# Altium schematic sheet 04.Mechanical.SchDoc
size A4; Organization: Electronic and Telecommunication Department - University of Moratuwa; Address1: Bandaranayake Mawatha; Address2: Moratuwa; Address3: Sri Lanka; Address4: 10400; DocumentNumber: 04; SheetNumber: 4; SheetTotal: 4; Page: Mechanical Information
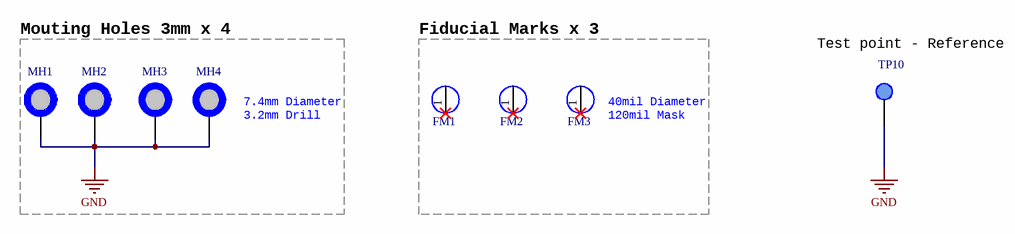
[diagram p0: 04.Mechanical.SchDoc]

## Parts
FM1  FM  [FM]  (value not drawn)  (no BOM)
FM2  FM  [FM]  (value not drawn)  (no BOM)
FM3  FM  [FM]  (value not drawn)  (no BOM)
MH1  MH_7.4MMC_3.2MMD  [MECHANICAL_M3]  (value not drawn)  (no BOM)
MH2  MH_7.4MMC_3.2MMD  [MECHANICAL_M3]  (value not drawn)  (no BOM)
MH3  MH_7.4MMC_3.2MMD  [MECHANICAL_M3]  (value not drawn)  (no BOM)
MH4  MH_7.4MMC_3.2MMD  [MECHANICAL_M3]  (value not drawn)  (no BOM)
TP10  (no value)  [tp]  (no BOM)

## Blocks framed on the sheet
Mouting Holes 3mm x 4: MH1-MH4
Fiducial Marks x 3: FM1-FM3

## Nets
GND: MH1.1 MH2.1 MH3.1 MH4.1 TP10.1(TP)

Not connected (* = marked no-connect by the designer): FM1 1(FM)*; FM2 1(FM)*; FM3 1(FM)*

## Notes on the sheet
- (near TP10) Test point - Reference
- (near MH4) 7.4mm Diameter
  3.2mm Drill
- (near FM3) 40mil Diameter 120mil Mask
- Title :
- Size:
- Date:
- Page :
- A4
- Number:
- Time:
- Revision:
- Sheet
- of
- Sheet Name :
- Drawn By :

## Library data of the parts
FM1-FM3 = FM: Fiducial mark
MH1-MH4 = Mounting_Hole2: Mounting Hole 7.4mm Diameter, 3.2mm Drill
TP10 = TP: Test Point